# EAGLE design Reg (EAGLE 9.6.2)
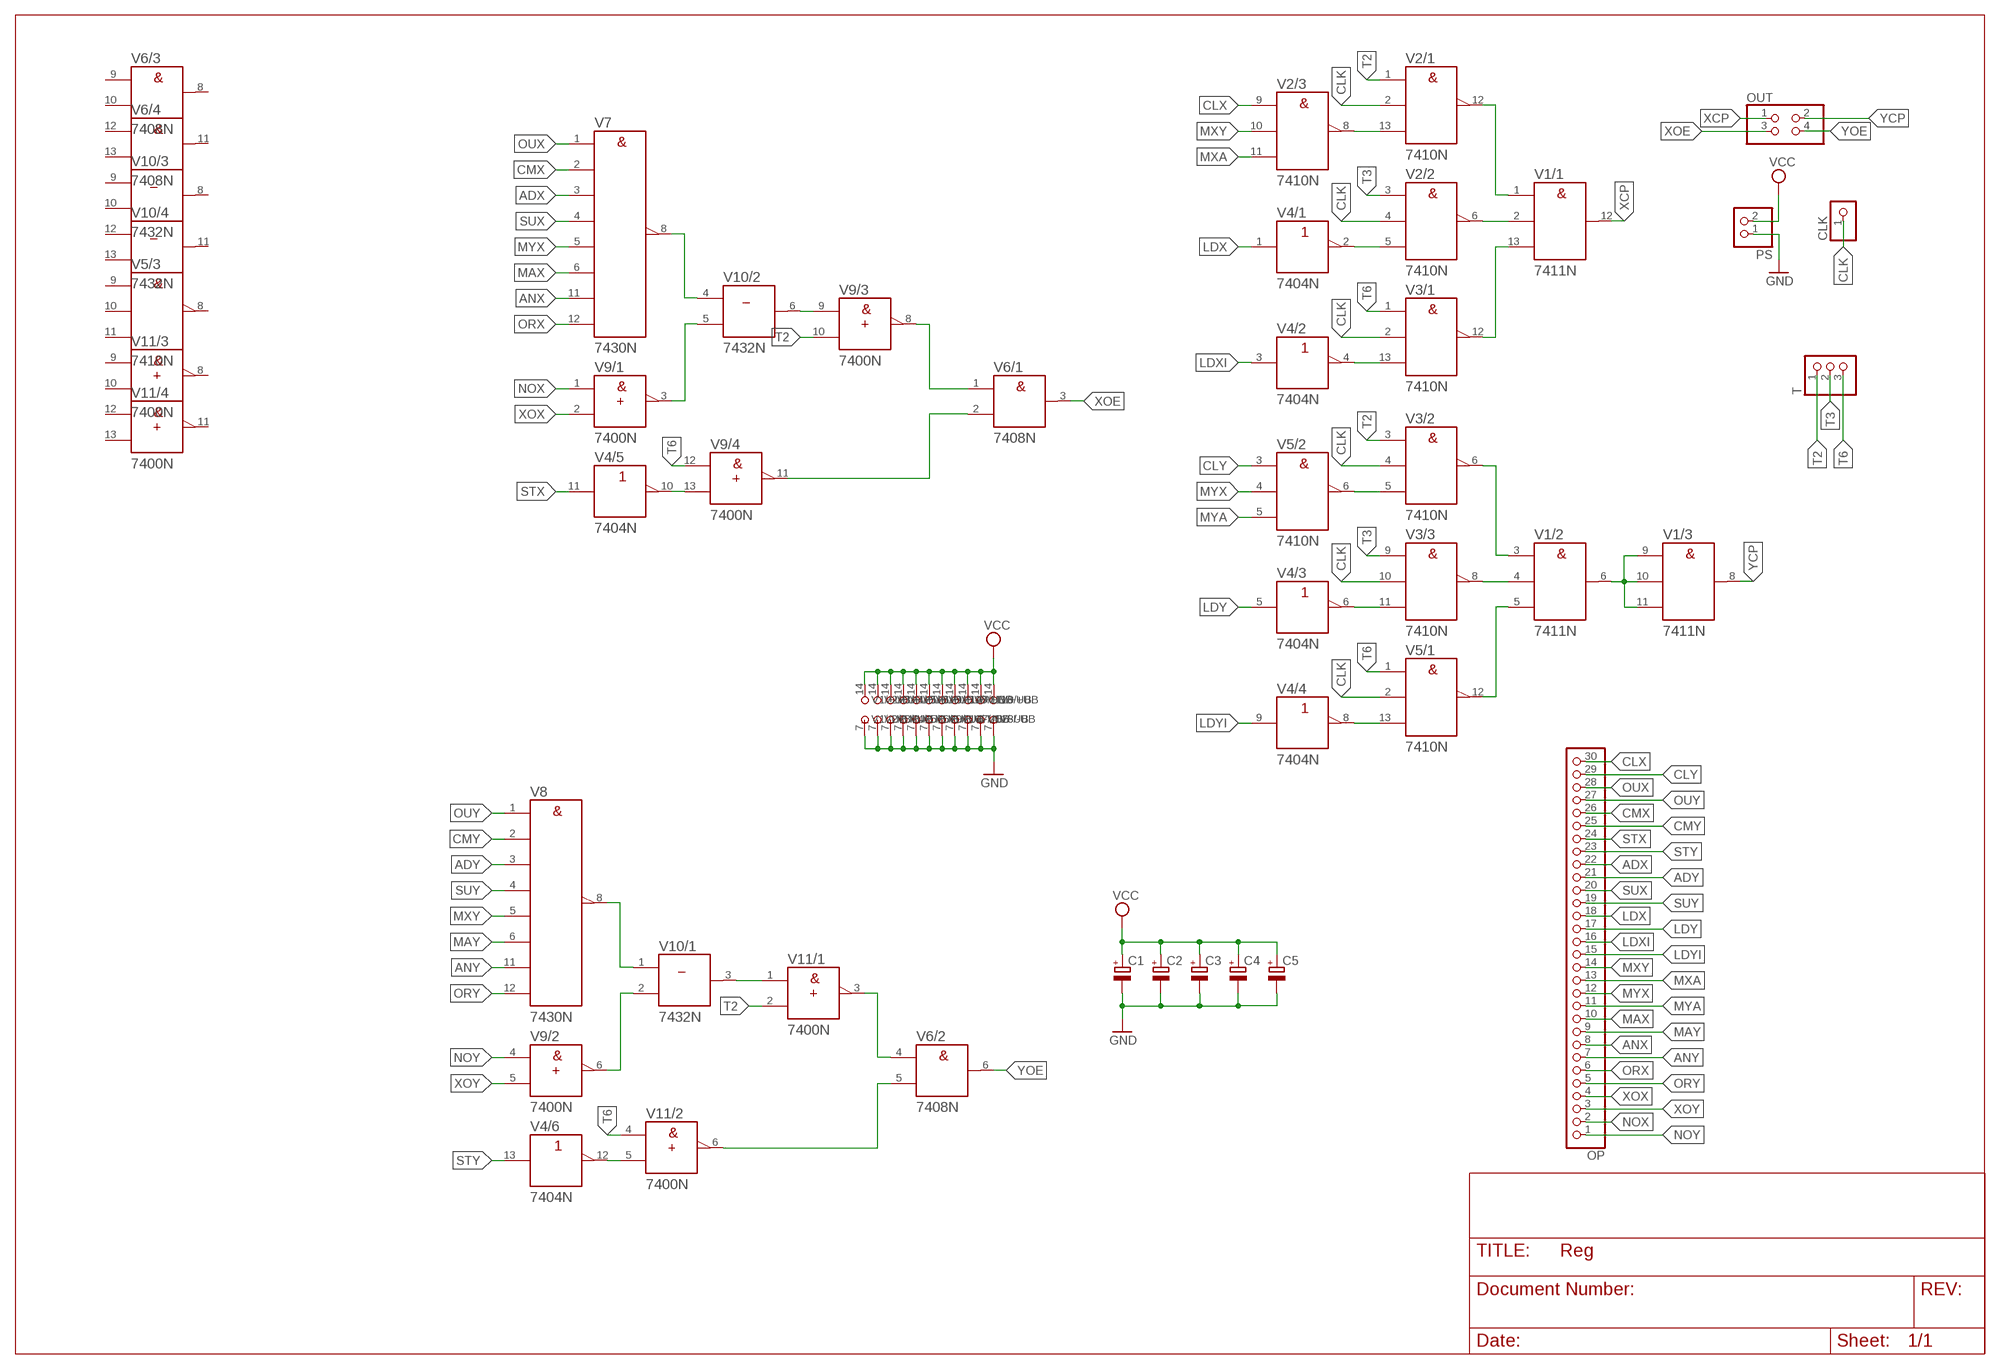
[diagram p0: schematic, sheet 1]

## Parts
C1  CPOL-EUE2-5  [E2-5]
C2  CPOL-EUE2-5  [E2-5]
C3  CPOL-EUE2-5  [E2-5]
C4  CPOL-EUE2-5  [E2-5]
C5  CPOL-EUE2-5  [E2-5]
CLK  PINHD-1X1  [1X01]
OP  PINHD-1X30  [1X30]
OUT  PINHD-2X2  [2X02]
PS  PINHD-1X2  [1X02]
T  PINHD-1X3  [1X03]
V1  7411N  [DIL14]
V2  7410N  [DIL14]
V3  7410N  [DIL14]
V4  7404N  [DIL14]
V5  7410N  [DIL14]
V6  7408N  [DIL14]
V7  7430N  [DIL14]
V8  7430N  [DIL14]
V9  7400N  [DIL14]
V10  7432N  [DIL14]
V11  7400N  [DIL14]

## Nets
ADX: OP.22 V7.3(C)
ADY: OP.21 V8.3(C)
ANX: OP.8 V7.11(G)
ANY: OP.7 V8.11(G)
CLK: CLK.1 V2.2(/1:B) V2.4(/2:B) V3.2(/1:B) V3.4(/2:B) V3.10(/3:B) V5.2(/1:B)
CLX: OP.30 V2.9(/3:A)
CLY: OP.29 V5.3(/2:A)
CMX: OP.26 V7.2(B)
CMY: OP.25 V8.2(B)
GND: C1.- C2.- C3.- C4.- C5.- PS.1 V1.7(/-UB:-UB) V2.7(/-UB:-UB) V3.7(/-UB:-UB) V4.7(/-UB:-UB) V5.7(/-UB:-UB) V6.7(/-UB:-UB) V7.7(-UB) V8.7(-UB) V9.7(/-UB:-UB) V10.7(/-UB:-UB) V11.7(/-UB:-UB)
LDX: OP.18 V4.1(/1:A)
LDXI: OP.16 V4.3(/2:A)
LDY: OP.17 V4.5(/3:A)
LDYI: OP.15 V4.9(/4:A)
MAX: OP.10 V7.6(F)
MAY: OP.9 V8.6(F)
MXA: OP.13 V2.11(/3:C)
MXY: OP.14 V2.10(/3:B) V8.5(E)
MYA: OP.11 V5.5(/2:C)
MYX: OP.12 V5.4(/2:B) V7.5(E)
N$1: V1.3(/2:A) V3.6(/2:Y)
N$2: V1.2(/1:B) V2.6(/2:Y)
N$3: V1.1(/1:A) V2.12(/1:Y)
N$4: V1.13(/1:C) V3.12(/1:Y)
N$5: V1.6(/2:Y) V1.9(/3:A) V1.10(/3:B) V1.11(/3:C)
N$6: V1.4(/2:B) V3.8(/3:Y)
N$7: V1.5(/2:C) V5.12(/1:Y)
N$8: V9.9(/3:A) V10.6(/2:Y)
N$9: V4.10(/5:Y) V9.13(/4:B)
N$10: V2.8(/3:Y) V2.13(/1:C)
N$11: V6.1(/1:A) V9.8(/3:Y)
N$12: V6.2(/1:B) V9.11(/4:Y)
N$13: V2.5(/2:C) V4.2(/1:Y)
N$14: V8.8(Y) V10.1(/1:A)
N$15: V9.6(/2:Y) V10.2(/1:B)
N$16: V3.13(/1:C) V4.4(/2:Y)
N$17: V3.5(/2:C) V5.6(/2:Y)
N$18: V10.3(/1:Y) V11.1(/1:A)
N$19: V6.4(/2:A) V11.3(/1:Y)
N$20: V3.11(/3:C) V4.6(/3:Y)
N$22: V4.12(/6:Y) V11.5(/2:B)
N$23: V4.8(/4:Y) V5.13(/1:C)
N$24: V6.5(/2:B) V11.6(/2:Y)
N$34: V7.8(Y) V10.4(/2:A)
N$35: V9.3(/1:Y) V10.5(/2:B)
NOX: OP.2 V9.1(/1:A)
NOY: OP.1 V9.4(/2:A)
ORX: OP.6 V7.12(H)
ORY: OP.5 V8.12(H)
OUX: OP.28 V7.1(A)
OUY: OP.27 V8.1(A)
STX: OP.24 V4.11(/5:A)
STY: OP.23 V4.13(/6:A)
SUX: OP.20 V7.4(D)
SUY: OP.19 V8.4(D)
T2: T.1 V2.1(/1:A) V3.3(/2:A) V9.10(/3:B) V11.2(/1:B)
T3: T.2 V2.3(/2:A) V3.9(/3:A)
T6: T.3 V3.1(/1:A) V5.1(/1:A) V9.12(/4:A) V11.4(/2:A)
VCC: C1.+ C2.+ C3.+ C4.+ C5.+ PS.2 V1.14(/+UB:+UB) V2.14(/+UB:+UB) V3.14(/+UB:+UB) V4.14(/+UB:+UB) V5.14(/+UB:+UB) V6.14(/+UB:+UB) V7.14(+UB) V8.14(+UB) V9.14(/+UB:+UB) V10.14(/+UB:+UB) V11.14(/+UB:+UB)
XCP: OUT.1 V1.12(/1:Y)
XOE: OUT.3 V6.3(/1:Y)
XOX: OP.4 V9.2(/1:B)
XOY: OP.3 V9.5(/2:B)
YCP: OUT.2 V1.8(/3:Y)
YOE: OUT.4 V6.6(/2:Y)
Unconnected: V5.8(/3:Y) V5.9(/3:A) V5.10(/3:B) V5.11(/3:C) V6.8(/3:Y) V6.9(/3:A) V6.10(/3:B) V6.11(/4:Y) V6.12(/4:A) V6.13(/4:B) V10.8(/3:Y) V10.9(/3:A) V10.10(/3:B) V10.11(/4:Y) V10.12(/4:A) V10.13(/4:B) V11.8(/3:Y) V11.9(/3:A) V11.10(/3:B) V11.11(/4:Y) V11.12(/4:A) V11.13(/4:B)

## Library data of the parts
C1-C5 = rcl:CPOL-EU: POLARIZED CAPACITOR, European symbol; SPICEPREFIX: C
CLK = pinhead:PINHD-1X1: PIN HEADER
OP = pinhead:PINHD-1X30: PIN HEADER
OUT = pinhead:PINHD-2X2: PIN HEADER
PS = pinhead:PINHD-1X2: PIN HEADER
T = pinhead:PINHD-1X3: PIN HEADER
V1 = 74ttl-din:74*11: Triple 3-input AND gate
V2 V3 V5 = 74ttl-din:74*10: Triple 3-input NAND gate
V4 = 74ttl-din:74*04: Hex INVERTER
V6 = 74ttl-din:74*08: Quad 2-input AND gate
V7 V8 = 74ttl-din:74*30: 8-input NAND gate
V9 V11 = 74ttl-din:74*00: Quad 2-input NAND gate
V10 = 74ttl-din:74*32: Quad 2-input OR gate

## Board
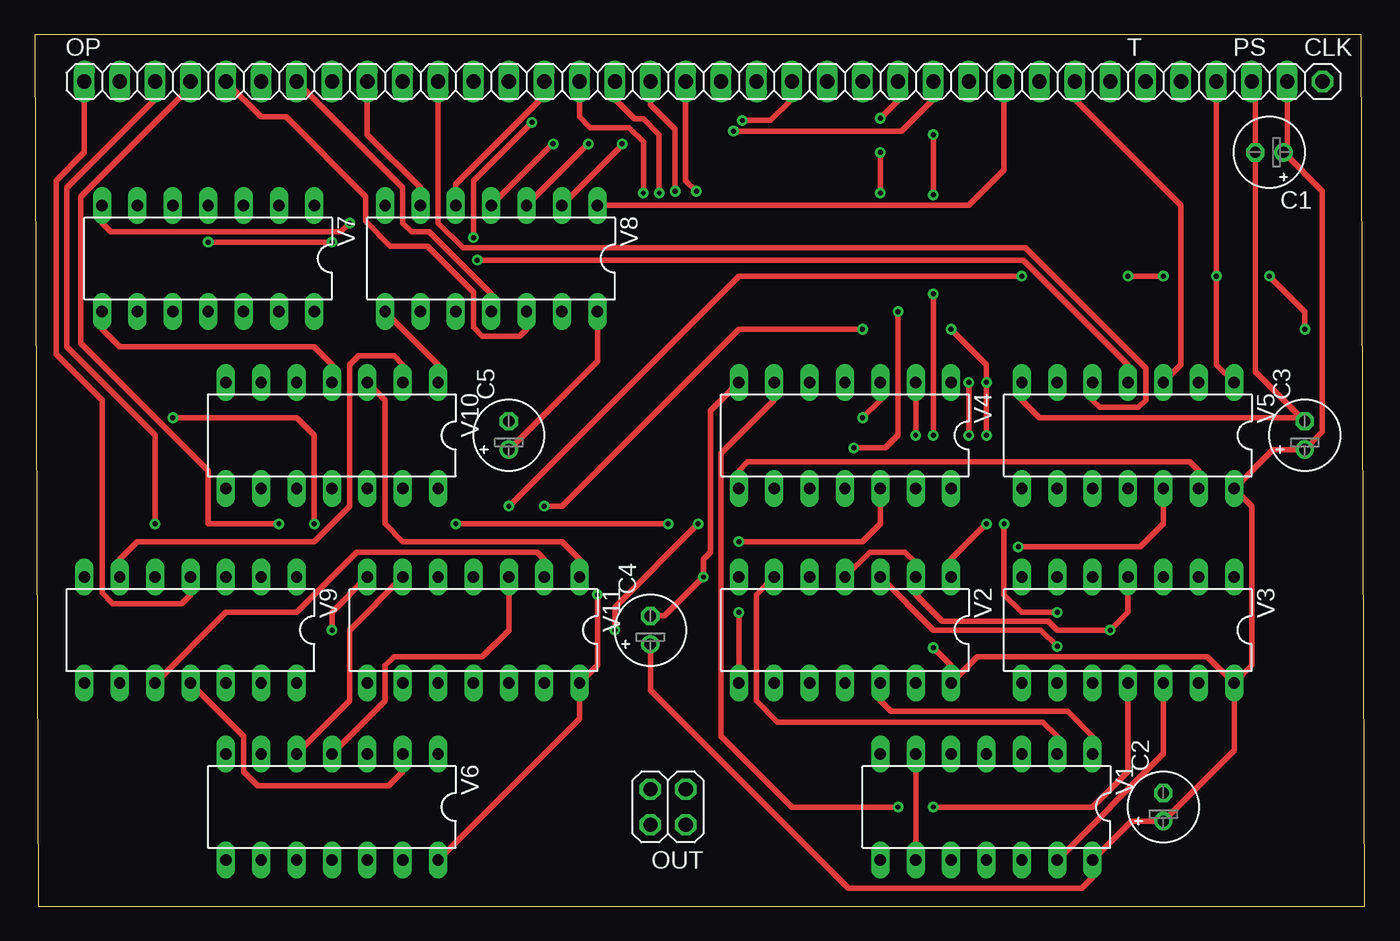
[diagram p1: board, top side]
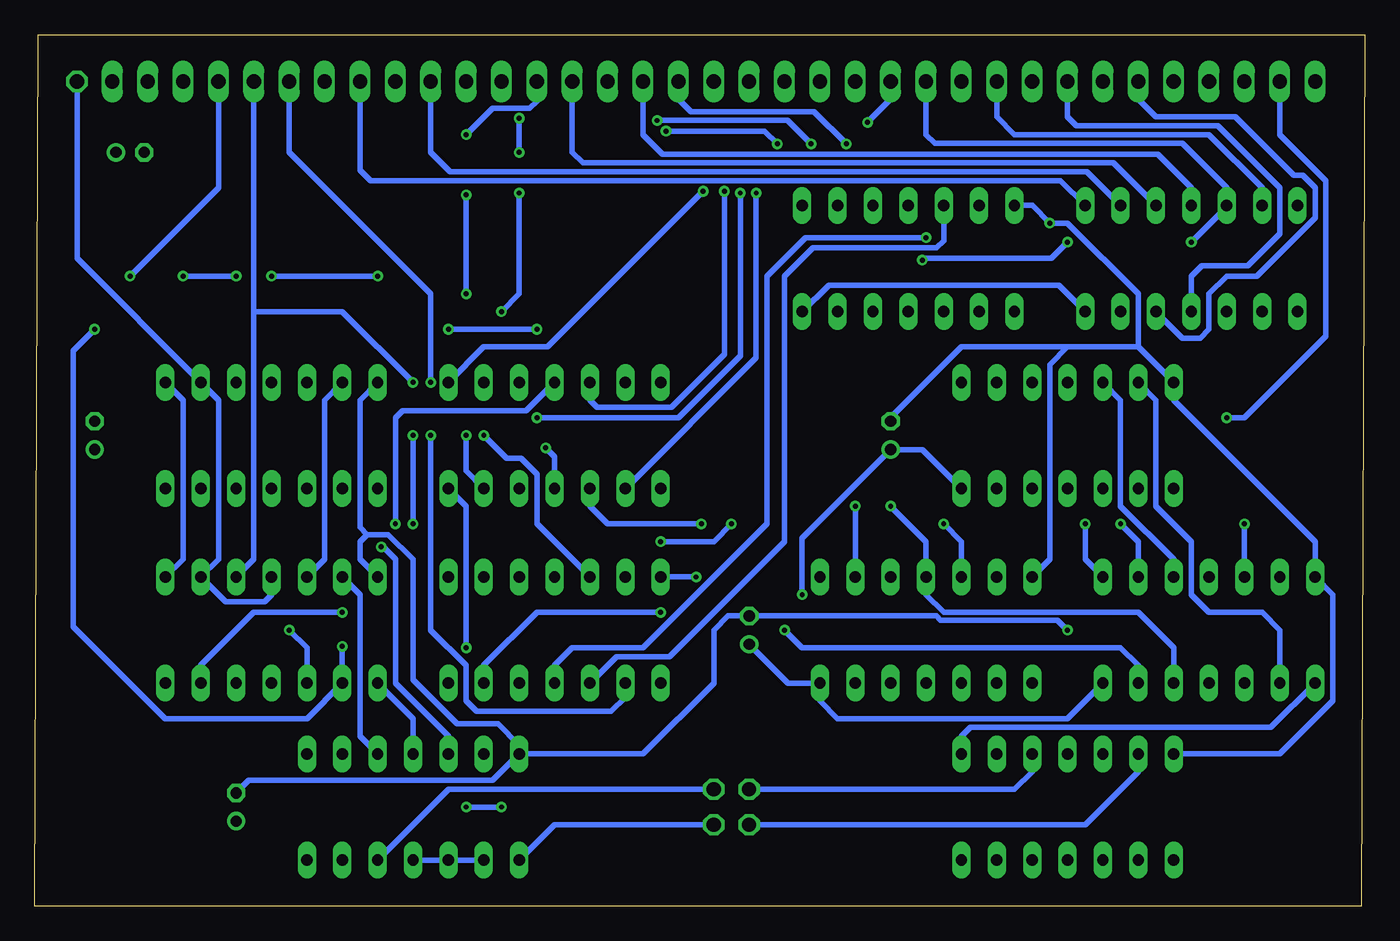
[diagram p2: board, bottom side, seen from below]

Size 95.48 x 62.53 mm. Coordinates in mm from the lower left corner, seen from the top.
Outline: 0.25,0 95.48,0 95.23,62.53 0,62.53 0.25,0
Copper layers (1*16): Top 0.035mm / dielectric 1.5mm / Bottom 0.035mm
Design rules "default": minimum track width 6mil, minimum drill 0.35mm, track to track 6mil, track to pad 6mil, pad to pad 6mil, via to via 6mil, smd to smd 6mil, copper to edge 40mil, drill to drill 6mil, minimum pad ring 10mil, minimum via ring 8mil, stop-mask expansion 4mil, vias tented up to drill 0mil, thermal gap 10mil

### Footprints (pad centres in the part's own frame; a part is rotated, then mirrored left to right if it is on the bottom)
E2-5 = drill 0.813 pad 1.27: + -1.016,0 | drill 0.813 pad 1.27 octagon: - 1.016,0
1X01 = drill 1.016 octagon: 1 0,0
1X30 = drill 1.016 long: 1 -36.83,0; 2 -34.29,0; 3 -31.75,0; 4 -29.21,0; 5 -26.67,0; 6 -24.13,0; 7 -21.59,0; 8 -19.05,0; 9 -16.51,0; 10 -13.97,0; 11 -11.43,0; 12 -8.89,0; 13 -6.35,0; 14 -3.81,0; 15 -1.27,0; 16 1.27,0; 17 3.81,0; 18 6.35,0; 19 8.89,0; 20 11.43,0; 21 13.97,0; 22 16.51,0; 23 19.05,0; 24 21.59,0; 25 24.13,0; 26 26.67,0; 27 29.21,0; 28 31.75,0; 29 34.29,0; 30 36.83,0
2X02 = drill 1.016 octagon: 1 -1.27,-1.27; 2 -1.27,1.27; 3 1.27,-1.27; 4 1.27,1.27
1X02 = drill 1.016 long: 1 -1.27,0; 2 1.27,0
1X03 = drill 1.016 long: 1 -2.54,0; 2 0,0; 3 2.54,0
DIL14 = drill 0.813 long: 1 -7.62,-3.81; 2 -5.08,-3.81; 3 -2.54,-3.81; 4 0,-3.81; 5 2.54,-3.81; 6 5.08,-3.81; 7 7.62,-3.81; 8 7.62,3.81; 9 5.08,3.81; 10 2.54,3.81; 11 0,3.81; 12 -2.54,3.81; 13 -5.08,3.81; 14 -7.62,3.81

### Placement (x,y rotation side)
C1  88.65,54.1 180 top
C2  81.03,7.11 90 top
C3  91.19,33.78 90 top
C4  44.2,19.81 90 top
C5  34.04,33.78 90 top
CLK  92.46,59.18 0 top
OP  40.39,59.18 0 top
OUT  45.47,7.11 180 top
PS  88.65,59.18 0 top
T  82.3,59.18 0 top
V1  68.33,7.11 180 top
V2  58.17,19.81 180 top
V3  78.49,19.81 180 top
V4  58.17,33.78 180 top
V5  78.49,33.78 180 top
V6  21.34,7.11 180 top
V7  12.45,46.48 180 top
V8  32.77,46.48 180 top
V9  11.18,19.81 180 top
V10  21.34,33.78 180 top
V11  31.5,19.81 180 top

### Tracks (layer width: path | path; a pad name or v marks a point on that pad's centre or on a via)
ADX
  Bottom 0.4: V7.3 18.03,53.34 56.13,53.34 56.9,54.1 OP.22
ADY  (via drill 0.35)
  Top 0.4: V8.3 39.72,54.71 v39.75,54.71 | v50.8,56.39 52.83,56.39 54.36,57.91 OP.21
  Bottom 0.4: v39.75,54.71 41.43,56.39 v50.8,56.39
ANX
  Bottom 0.4: V7.11 12.45,45.21 11.68,45.97 8.38,45.97 6.1,48.26 6.1,51.56 10.54,56.01 20.7,56.01 21.34,56.64 OP.8
ANY
  Top 0.4: OP.7 26.42,51.56 26.42,49.02 27.05,48.39 28.32,48.39 32.77,43.94 V8.11
CLK  (via drill 0.35)
  Top 0.4: V3.4 78.49,21.08 v77.22,19.81 73.41,19.81 72.77,20.45 65.15,20.45 63.25,22.35 V2.2 63.25,24.64 62.48,25.4 59.94,25.4 V2.4
  Bottom 0.4: CLK.1 92.46,46.48 V5.2 82.3,36.32 82.3,24.89 V3.2 81.79,21.84 78.99,21.84 78.49,22.35 V3.4 | v77.22,19.81 75.95,18.54 V3.10
CLX  (via drill 0.35)
  Top 0.4: v67.06,37.59 v67.06,33.78
  Bottom 0.4: v67.06,37.59 67.06,43.94 77.22,54.1 OP.30 | v67.06,33.78 67.06,19.81 64.52,17.27 64.52,14.73 63.75,13.97 54.1,13.97 53.09,14.99 V2.9
CLY
  Top 0.4: V5.3 82.3,38.86 82.3,50.29 74.68,57.91 OP.29
CMX
  Bottom 0.4: V7.2 19.94,52.7 65.66,52.7 67.06,54.1 OP.26
CMY  (via drill 0.35)
  Top 0.4: V8.2 42.16,54.61 v42.16,54.71 | v50.16,55.63 62.23,55.63 64.52,57.91 OP.25
  Bottom 0.4: v42.16,54.71 43.08,55.63 v50.16,55.63
GND  (via drill 0.35)
  Top 0.4: V7.7 4.83,49.02 5.46,48.39 21.97,48.39 v22.61,49.02 | v21.34,19.81 21.34,21.08 V11.7 | PS.1 87.63,58.93 C1.- 87.63,38.35 C3.- 90.93,35.05 72.14,35.05 70.87,36.32 V5.7 | C4.- 45.21,20.83 v48.01,23.62 48.01,24.89 48.51,25.4 48.51,35.56 V4.7
  Bottom 0.4: V8.7 23.88,50.29 v22.61,49.02 21.34,49.02 16.26,43.94 16.26,40.13 | 16.26,40.13 V10.7 13.72,36.32 3.56,26.16 V9.7 2.29,22.35 2.29,14.73 6.1,10.92 V6.7 | V11.7 22.61,24.89 22.61,38.86 21.34,40.13 | 21.34,40.13 16.26,40.13 | C5.- 34.04,35.05 28.96,40.13 21.34,40.13 | v21.34,19.81 22.05,20.53 30.46,20.53 30.75,20.83 C4.- 45.72,20.83 46.74,19.81 46.74,16 51.82,10.92 V1.7 | C2.- 80.14,9.02 62.61,9.02 V1.7 | V3.7 72.14,24.89 72.14,26.16 71.63,26.67 | 71.63,26.67 70.1,26.67 68.33,24.89 68.33,16.26 65.15,13.08 62.23,13.08 60.71,11.56 V1.7 | V2.7 v48.01,23.62 | V5.7 72.14,36.32 72.14,27.18 71.63,26.67
LDX  (via drill 0.35)
  Top 0.4: v47.5,51.31 46.74,52.07 OP.18
  Bottom 0.4: v47.5,51.31 58.67,40.13 63.25,40.13 V4.1
LDXI  (via drill 0.35)
  Top 0.4: OP.16 41.66,57.91 43.05,56.52 43.69,56.52 44.83,55.37 v44.83,51.18 | v59.44,35.05 60.71,36.32 V4.3
  Bottom 0.4: v44.83,51.18 44.83,39.5 49.28,35.05 v59.44,35.05
LDY  (via drill 0.35)
  Top 0.4: v45.97,51.31 45.97,55.75 44.2,57.53 OP.17
  Bottom 0.4: v45.97,51.31 45.97,39.62 49.78,35.81 55.12,35.81 55.63,36.32 V4.5
LDYI  (via drill 0.35)
  Top 0.4: OP.15 39.12,56.64 39.88,55.88 42.67,55.88 43.69,54.86 v43.69,51.18
  Bottom 0.4: v43.69,51.18 43.69,39.37 V4.9
MAX
  Bottom 0.4: V7.6 7.37,51.56 11.18,55.37 25.15,55.37 26.42,56.64 OP.10
MAY
  Top 0.4: V8.6 27.69,51.56 23.88,55.37 OP.9
MXA  (via drill 0.35)
  Top 0.4: v35.7,56.25 31.5,52.05 v31.5,47.98
  Bottom 0.4: OP.13 34.04,57.91 v35.7,56.25 | v31.5,47.98 40.16,47.98 42.93,45.21 42.93,27.43 51.82,18.54 56.9,18.54 58.17,17.27 V2.11
MXY
  Top 0.4: OP.14 36.58,58.17 30.23,51.82 V8.5
  Bottom 0.4: V2.10 53.72,17.91 49.91,17.91 41.66,26.16 41.66,45.21 39.62,47.24 30.73,47.24 30.23,47.75 V8.5
MYA
  Top 0.4: V5.5 75.95,36.32 76.45,35.81 79.25,35.81 79.76,36.32 79.76,38.61 71.12,47.24 30.73,47.24 28.96,49.02 OP.11
MYX  (via drill 0.35)
  Top 0.4: v21.34,47.66 v12.45,47.66 | v31.76,46.36 70.98,46.36 78.49,38.86 V5.4
  Bottom 0.4: OP.12 31.5,55.37 30.86,54.74 13.08,54.74 9.91,51.56 V7.5 9.91,50.2 v12.45,47.66 | v21.34,47.66 22.51,46.48 31.64,46.48 v31.76,46.36
N$1
  Bottom 0.4: V1.3 72.14,12.19 72.14,22.35 V3.6
N$2
  Top 0.4: V1.2 73.41,12.19 72.39,13.21 53.34,13.21 51.82,14.73 51.82,22.35 V2.6
N$3
  Top 0.4: V2.12 60.71,14.73 61.47,13.97 74.17,13.97 75.95,12.19 V1.1
N$4
  Top 0.4: V3.12 81.03,10.92 V1.13
N$5
  Top 0.4: V1.9 V1.6
  Bottom 0.4: V1.11 V1.10 V1.9
N$6
  Bottom 0.4: V1.4 68.33,13.46 V3.8
N$7  (via drill 0.35)
  Top 0.4: v70.61,25.78 79.38,25.78 81.03,27.43 V5.12
  Bottom 0.4: V1.5 65.79,12.19 69.6,16 69.6,24.89 70.48,25.78 v70.61,25.78
N$8
  Bottom 0.4: V10.6 14.99,36.32 14.99,28.7 12.45,26.16 12.45,22.35 11.18,21.08 7.37,21.08 6.1,19.81 V9.9
N$9  (via drill 0.35)
  Top 0.4: v41.66,19.81 41.66,21.46 v47.62,27.43
  Bottom 0.4: V9.13 16.26,17.27 17.53,18.54 40.39,18.54 v41.66,19.81 | v47.62,27.43 54.36,27.43 55.63,28.7 V4.10
N$10  (via drill 0.35)
  Top 0.4: V2.8 v50.55,21.08
  Bottom 0.4: v50.55,21.08 59.44,21.08 63.25,17.27 V2.13
N$11
  Bottom 0.4: V6.1 28.96,12.19 28.32,12.83 6.73,12.83 V9.8
N$12
  Top 0.4: V6.2 26.42,9.65 25.4,8.64 16,8.64 14.99,9.65 14.99,12.19 V9.11
N$13  (via drill 0.35)
  Top 0.4: V4.2 v63.25,33.78
  Bottom 0.4: v63.25,33.78 61.59,32.13 60.58,32.13 59.44,30.99 59.44,27.43 V2.5
N$14
  Top 0.4: V8.8 28.96,38.86 V10.1
N$15
  Top 0.4: V10.2 26.42,38.86 25.78,39.5 23.24,39.5 22.61,38.86 22.61,28.7 20.07,26.16 7.37,26.16 6.1,24.89 V9.6
N$16  (via drill 0.35)
  Top 0.4: v73.41,21.08 70.87,21.08 69.6,22.35 v69.6,27.43
  Bottom 0.4: V3.13 83.57,17.27 79.76,21.08 v73.41,21.08 | v69.6,27.43 69.6,35.05 69.09,35.56 60.2,35.56 V4.4
N$17
  Bottom 0.4: V5.6 74.68,36.32 74.68,24.89 V3.5
N$18
  Top 0.4: V10.3 25.15,36.32 25.15,27.43 26.42,26.16 37.85,26.16 39.12,24.89 V11.1
N$19
  Top 0.4: V11.3 34.04,19.81 32.13,17.91 25.78,17.91 25.15,17.27 25.15,14.73 V6.4
N$20  (via drill 0.35)
  Top 0.4: V4.6 53.09,36.32 49.28,32.51 49.28,12.19 54.36,7.11 v61.98,7.11 | V3.11 78.49,9.65 75.95,7.11 v64.52,7.11
  Bottom 0.4: v61.98,7.11 v64.52,7.11
N$22  (via drill 0.35)
  Top 0.4: V4.12 60.71,27.43 59.44,26.16 v50.55,26.16 | v45.47,27.43 v30.23,27.43
  Bottom 0.4: v50.55,26.16 46.74,26.16 v45.47,27.43 | v30.23,27.43 28.96,26.16 V11.5
N$23
  Top 0.4: V5.13 83.57,31.24 82.93,31.88 51.18,31.88 50.55,31.24 V4.8
N$24
  Top 0.4: V11.6 22.61,19.81 22.61,14.73 V6.5
N$34
  Top 0.4: V7.8 4.83,41.4 6.1,40.13 20.07,40.13 21.34,38.86 V10.4
N$35
  Bottom 0.4: V9.3 13.72,24.89 17.53,28.7 17.53,36.32 V10.5
NOX  (via drill 0.35)
  Top 0.4: v9.91,35.05 18.8,35.05 20.07,33.78 v20.07,27.43
  Bottom 0.4: OP.2 6.1,55.37 2.79,52.07 2.79,40.89 8.64,35.05 v9.91,35.05 | v20.07,27.43 20.07,24.89 V9.1
NOY
  Top 0.4: V9.4 11.18,22.35 10.54,21.72 5.59,21.72 4.83,22.48 4.83,36.32 1.52,39.62 1.52,52.07 3.56,54.1 OP.1
ORX
  Bottom 0.4: OP.6 16.26,57.91 14.99,56.64 9.27,56.64 5.08,52.45 4.45,52.45 3.56,51.56 3.56,49.4 7.75,45.21 9.91,45.21 11.18,43.94 11.18,41.4 11.81,40.77 13.08,40.77 V7.12
ORY
  Top 0.4: V8.12 35.31,41.4 34.8,40.89 32.13,40.89 31.5,41.53 31.5,44.07 28.19,47.37 25.53,47.37 23.75,49.15 23.75,50.93 18.03,56.64 16.26,56.64 OP.5
OUX
  Bottom 0.4: V7.1 21.84,52.07 71.37,52.07 72.14,52.83 OP.28
OUY
  Top 0.4: V8.1 67.06,50.29 69.6,52.83 OP.27
STX  (via drill 0.35)
  Top 0.4: OP.24 61.98,57.82 v60.71,56.55 | v60.71,54.1 v60.71,51.18 | v61.98,42.67 61.98,33.78 61.09,32.89 v58.8,32.89
  Bottom 0.4: v60.71,56.55 v60.71,54.1 | v60.71,51.18 60.71,43.94 v61.98,42.67 | v58.8,32.89 58.17,32.26 V4.11
STY  (via drill 0.35)
  Top 0.4: v64.52,51.05 v64.52,55.37 | v64.52,43.94 v64.52,33.78
  Bottom 0.4: V4.13 64.52,31.24 v64.52,33.78 | v64.52,43.94 v64.52,51.05 | v64.52,55.37 62.61,57.28 59.94,57.28 59.44,57.78 OP.23
SUX
  Bottom 0.4: OP.20 51.82,55.37 50.42,53.98 14.86,53.98 12.45,51.56 V7.4
SUY  (via drill 0.35)
  Top 0.4: V8.4 37.18,54.71 v37.21,54.71
  Bottom 0.4: v37.21,54.71 39.53,57.02 48.39,57.02 49.28,57.91 OP.19
T2  (via drill 0.35)
  Top 0.4: V9.10 13.72,21.08 18.8,21.08 23.11,25.4 36.07,25.4 36.58,24.89 V11.2 | v68.33,33.78 v68.33,37.59 68.33,38.86 v65.79,41.4 | v68.33,27.43 65.79,24.89 V2.1 | v59.44,41.4 50.55,41.4 37.85,28.7 v36.58,28.7
  Bottom 0.4: V3.3 79.76,24.89 79.76,42.67 | T.1 79.76,42.67 | 79.76,42.67 73.41,42.67 v68.33,37.59 | v68.33,33.78 v68.33,27.43 | v65.79,41.4 v59.44,41.4 | v36.58,28.7 V11.2
T3  (via drill 0.35)
  Top 0.4: v73.41,18.64 72.23,19.81 64.52,19.81 V2.3 | v88.65,45.21 91.19,42.67 v91.19,41.4
  Bottom 0.4: v73.41,18.64 V3.9 75.95,13.46 86.11,13.46 92.71,20.07 92.71,39.88 v91.19,41.4 | T.2 82.3,51.56 v88.65,45.21
T6  (via drill 0.35)
  Top 0.4: V5.1 84.84,38.86 v84.84,45.21 T.3 | v34.04,28.7 50.55,45.21 v70.87,45.21 | v78.49,45.21 v81.03,45.21
  Bottom 0.4: V9.12 13.72,18.54 16.26,21.08 30.23,21.08 31.5,22.35 V11.4 31.5,26.16 v34.04,28.7 | V5.1 84.84,36.32 84.84,24.89 V3.1 | v70.87,45.21 v78.49,45.21 | v81.03,45.21 v84.84,45.21
VCC  (via drill 0.35)
  Top 0.4: V6.14 39.12,13.46 V11.14 40.39,17.27 v40.39,22.35 | PS.2 89.92,54.36 C1.+ 92.46,51.31 92.46,34.04 C3.+ 88.9,32.77 V5.14 87.38,28.7 87.38,17.27 V3.14 | V3.14 84.2,17.91 67.69,17.91 V2.14 65.79,17.27 v64.52,18.54 | V3.14 86.11,11.18 C2.+ 78.74,6.1 V1.14 75.95,2.03 75.18,1.27 58.42,1.27 44.2,15.49 C4.+ | C5.+ 40.39,39.12 V8.14
  Bottom 0.4: V8.14 38.48,44.58 21.97,44.58 V7.14 | V10.14 31.75,32.77 C5.+ 40.39,26.42 v40.39,22.35 | V9.14 21.34,13.46 37.85,13.46 39.12,14.73 V11.14 41.4,16 C4.+ | V4.14 64.52,28.7 v64.52,18.54
XCP
  Bottom 0.4: OUT.1 65.79,8.38 V1.12
XOE
  Bottom 0.4: OUT.3 25.15,8.38 23.88,9.65 V6.3
XOX  (via drill 0.35)
  Top 0.4: v17.53,27.43 12.45,27.43 12.45,31.24 3.3,40.39 3.3,50.93 11.18,58.8 OP.4
  Bottom 0.4: v17.53,27.43 16.26,26.16 V9.2
XOY  (via drill 0.35)
  Top 0.4: OP.3 8.64,57.91 2.29,51.56 2.29,40.13 8.64,33.78 v8.64,27.43
  Bottom 0.4: v8.64,27.43 V9.5
YCP
  Bottom 0.4: V1.8 58.17,5.84 OUT.2
YOE
  Bottom 0.4: V6.6 16.26,9.65 20.07,5.84 OUT.4